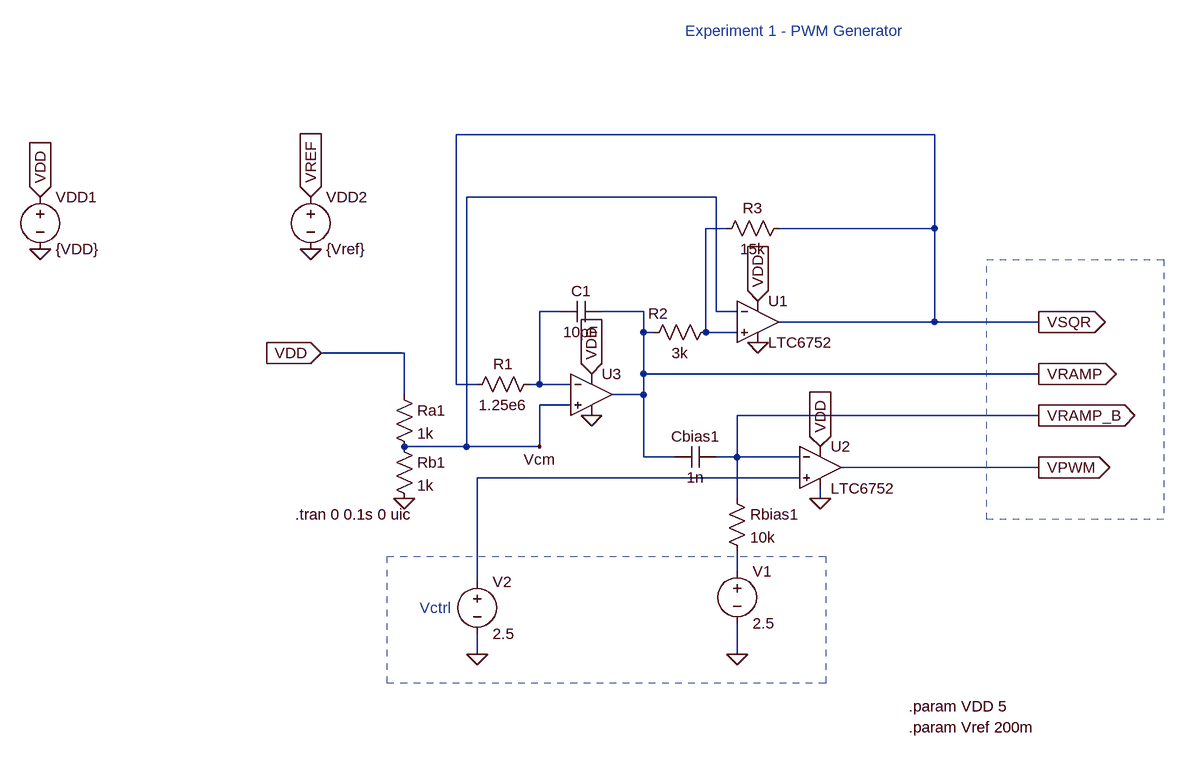
[diagram p0: schematic Ex 1.asc]
Ex 1.asc, the LTspice schematic file:
Version 4
SHEET 1 884 680
WIRE 528 -304 -208 -304
WIRE 192 -208 -192 -208
WIRE 208 -160 176 -160
WIRE 528 -160 528 -304
WIRE 528 -160 288 -160
WIRE -48 -32 -80 -32
WIRE 80 -32 16 -32
WIRE 192 -32 192 -208
WIRE 224 -32 192 -32
WIRE 528 -16 528 -160
WIRE 528 -16 288 -16
WIRE 688 -16 528 -16
WIRE 80 0 80 -32
WIRE 96 0 80 0
WIRE 176 0 176 -160
WIRE 224 0 176 0
WIRE -288 32 -416 32
WIRE 80 64 80 0
WIRE 688 64 80 64
WIRE -208 80 -208 -304
WIRE -176 80 -208 80
WIRE -80 80 -80 -32
WIRE -80 80 -96 80
WIRE -32 80 -80 80
WIRE -288 96 -288 32
WIRE 80 96 80 64
WIRE 80 96 32 96
WIRE -32 112 -80 112
WIRE 688 128 224 128
WIRE -192 176 -192 -208
WIRE -192 176 -288 176
WIRE -80 176 -80 112
WIRE -80 176 -192 176
WIRE 80 192 80 96
WIRE 128 192 80 192
WIRE 224 192 224 128
WIRE 224 192 192 192
WIRE 320 192 224 192
WIRE 688 208 384 208
WIRE 320 224 -176 224
WIRE 224 256 224 192
WIRE 352 256 352 240
WIRE 224 368 224 336
WIRE -176 384 -176 224
WIRE -176 496 -176 464
WIRE 224 496 224 448
FLAG -288 256 0
FLAG 256 16 0
FLAG 0 128 0
FLAG 352 256 0
FLAG -80 176 Vcm
FLAG 688 -16 VSQR
IOPIN 688 -16 Out
FLAG 688 64 VRAMP
IOPIN 688 64 Out
FLAG 0 64 VDD
IOPIN 0 64 In
FLAG 256 -48 VDD
IOPIN 256 -48 In
FLAG 352 176 VDD
IOPIN 352 176 In
FLAG 688 208 VPWM
IOPIN 688 208 Out
FLAG 688 128 VRAMP_B
IOPIN 688 128 Out
FLAG -416 32 VDD
IOPIN -416 32 In
FLAG -848 -128 0
FLAG -848 -208 VDD
IOPIN -848 -208 In
FLAG -432 -128 0
FLAG -432 -208 VREF
IOPIN -432 -208 In
FLAG 224 496 0
FLAG -176 496 0
SYMBOL res -304 80 R0
SYMATTR InstName Ra1
SYMATTR Value 1k
SYMBOL res -304 160 R0
SYMATTR InstName Rb1
SYMATTR Value 1k
SYMBOL res -80 64 R90
WINDOW 0 0 56 VBottom 2
WINDOW 3 32 56 VTop 2
SYMATTR InstName R1
SYMATTR Value 1.25e6
SYMBOL cap 16 -48 R90
WINDOW 0 0 32 VBottom 2
WINDOW 3 32 32 VTop 2
SYMATTR InstName C1
SYMATTR Value 10pF
SYMBOL res 192 -16 R90
WINDOW 0 3 89 VBottom 2
WINDOW 3 32 56 VTop 2
SYMATTR InstName R2
SYMATTR Value 3k
SYMBOL res 304 -176 R90
WINDOW 0 0 56 VBottom 2
WINDOW 3 32 56 VTop 2
SYMATTR InstName R3
SYMATTR Value 15k
SYMBOL cap 192 176 R90
WINDOW 0 0 32 VBottom 2
WINDOW 3 32 32 VTop 2
SYMATTR InstName Cbias1
SYMATTR Value 1n
SYMBOL res 208 240 R0
SYMATTR InstName Rbias1
SYMATTR Value 10k
SYMBOL voltage 224 352 R0
WINDOW 123 0 0 Left 0
WINDOW 39 0 0 Left 0
SYMATTR InstName V1
SYMATTR Value 2.5
SYMBOL Comparators\\LTC6752 256 -80 R0
SYMATTR InstName U1
SYMBOL Comparators\\LTC6752 352 144 R0
SYMATTR InstName U2
SYMBOL OpAmps\\UniversalOpamp2 0 96 R0
SYMATTR InstName U3
SYMBOL voltage -848 -224 R0
WINDOW 123 0 0 Left 0
WINDOW 39 0 0 Left 0
SYMATTR InstName VDD1
SYMATTR Value {VDD}
SYMBOL voltage -432 -224 R0
WINDOW 123 0 0 Left 0
WINDOW 39 0 0 Left 0
SYMATTR InstName VDD2
SYMATTR Value {Vref}
SYMBOL voltage -176 368 R0
WINDOW 123 0 0 Left 0
WINDOW 39 0 0 Left 0
SYMATTR InstName V2
SYMATTR Value 2.5
TEXT -456 280 Left 2 !.tran 0 0.1s 0 uic
TEXT 488 576 Left 2 !.param VDD 5
TEXT 488 608 Left 2 !.param Vref 200m
TEXT -264 424 Left 2 ;Vctrl
TEXT 144 -464 Left 2 ;Experiment 1 - PWM Generator
RECTANGLE Normal 360 540 -314 345 2
RECTANGLE Normal 880 288 608 -112 2

The netlist it stands for:
* Ex 1.asc
Ra1 VDD Vcm 1k
Rb1 Vcm 0 1k
R1 N002 VSQR 1.25e6
C1 VRAMP N002 10pF
R2 N001 VRAMP 3k
R3 VSQR N001 15k
Cbias1 VRAMP_B VRAMP 1n
Rbias1 VRAMP_B N004 10k
V1 N004 0 2.5
XU1 N001 Vcm VDD 0 VSQR LTC6752  ; pins In+ In- V+ V- OUT
XU2 N003 VRAMP_B VDD 0 VPWM LTC6752  ; pins In+ In- V+ V- OUT
XU3 Vcm N002 VDD 0 VRAMP level.2 Avol=1Meg GBW=10Meg Slew=10Meg ilimit=25m rail=0 Vos=0 phimargin=45 en=0 enk=0 in=0 ink=0 Rin=500Meg  ; pins IN+ IN- V+ V- OUT
VDD1 VDD 0 {VDD}
VDD2 VREF 0 {Vref}
V2 N003 0 2.5
.tran 0 0.1s 0 uic
.param VDD 5
.param Vref 200m
* Vctrl
* Experiment 1 - PWM Generator
.lib LTC7.lib
.lib UniversalOpamps2.sub
.backanno
.end